# EAGLE design DC_IDE_Adapter (EAGLE 6.0)
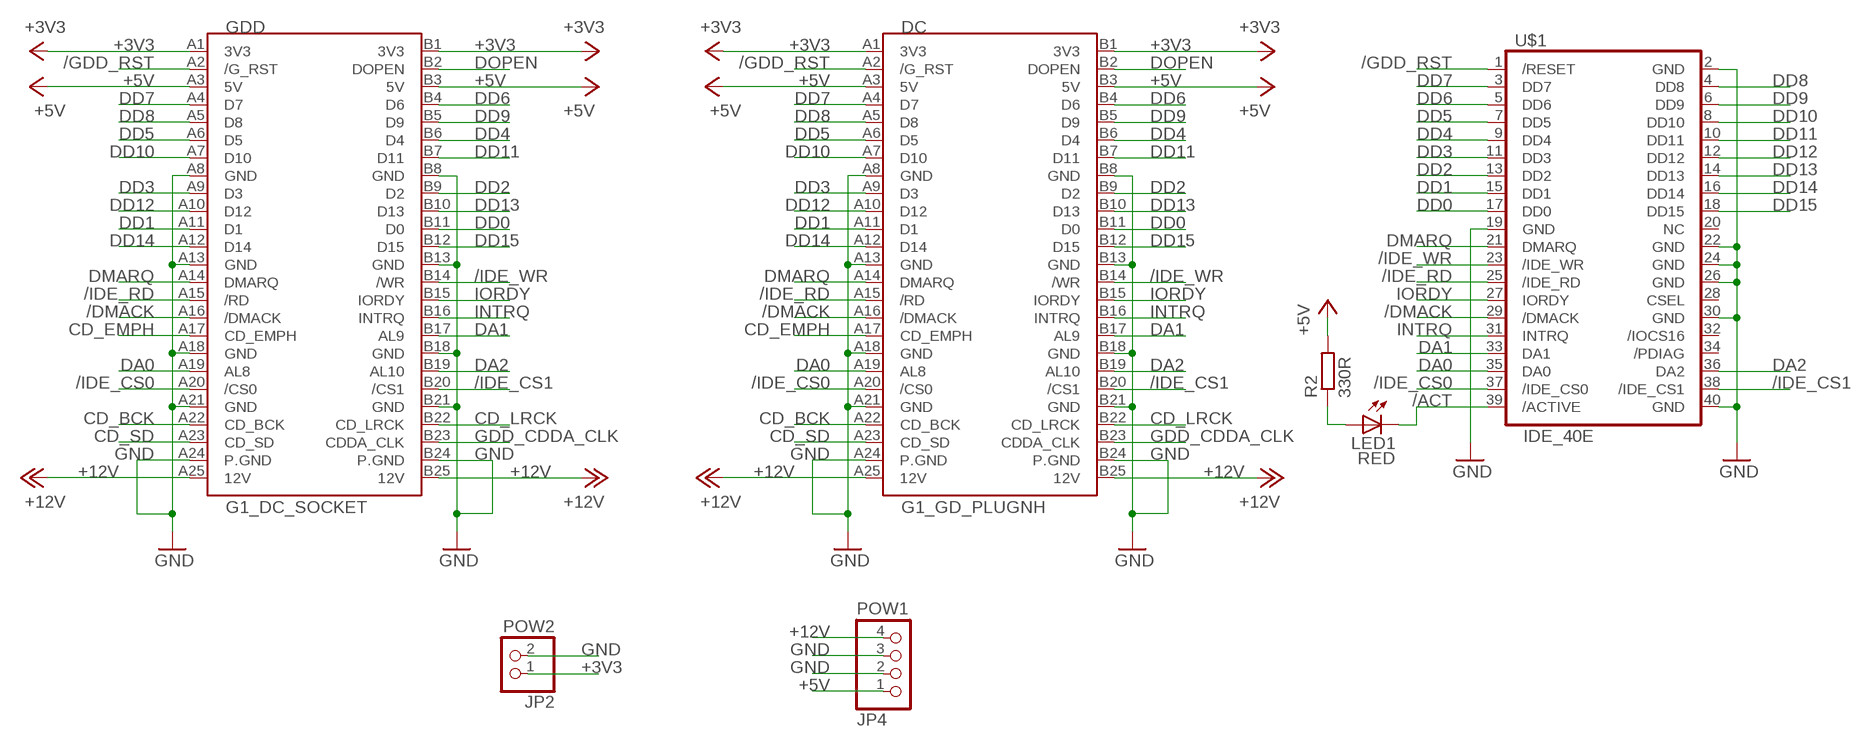
[diagram p0: schematic, sheet 1]

## Parts
DC  G1_GD_PLUGNH  [52584-0579-NOHOLES]
GDD  G1_DC_SOCKET  [53408-0579]
JP2  POW2  PINHD-1X2/90  [1X02/90]
JP4  POW1  PINHD-1X4/90  [1X04/90]
LED1  RED  LED3MM  [LED3MM]
R2  330R  R-EU_R0603  [R0603]
U$1  IDE_40E  [IDE_40_EDGE]

## Nets
+3V3: DC.A1(3V3) DC.B1(3V3) GDD.A1(3V3) GDD.B1(3V3) JP2.1
+5V: DC.A3(5V) DC.B3(5V) GDD.A3(5V) GDD.B3(5V) JP4.1 R2.2
+12V: DC.A25(12V) DC.B25(12V) GDD.A25(12V) GDD.B25(12V) JP4.4
/ACT: LED1.K(C) U$1.39(/ACTIVE)
/DMACK: DC.A16(/DMACK) GDD.A16(/DMACK) U$1.29(/DMACK)
/GDD_RST: DC.A2(/G_RST) GDD.A2(/G_RST) U$1.1(/RESET)
/IDE_CS0: DC.A20(/CS0) GDD.A20(/CS0) U$1.37(/IDE_CS0)
/IDE_CS1: DC.B20(/CS1) GDD.B20(/CS1) U$1.38(/IDE_CS1)
/IDE_RD: DC.A15(/RD) GDD.A15(/RD) U$1.25(/IDE_RD)
/IDE_WR: DC.B14(/WR) GDD.B14(/WR) U$1.23(/IDE_WR)
CD_BCK: DC.A22(CD_BCK) GDD.A22(CD_BCK)
CD_EMPH: DC.A17(CD_EMPH) GDD.A17(CD_EMPH)
CD_LRCK: DC.B22(CD_LRCK) GDD.B22(CD_LRCK)
CD_SD: DC.A23(CD_SD) GDD.A23(CD_SD)
DA0: DC.A19(AL8) GDD.A19(AL8) U$1.35(DA0)
DA1: DC.B17(AL9) GDD.B17(AL9) U$1.33(DA1)
DA2: DC.B19(AL10) GDD.B19(AL10) U$1.36(DA2)
DD0: DC.B11(D0) GDD.B11(D0) U$1.17(DD0)
DD1: DC.A11(D1) GDD.A11(D1) U$1.15(DD1)
DD2: DC.B9(D2) GDD.B9(D2) U$1.13(DD2)
DD3: DC.A9(D3) GDD.A9(D3) U$1.11(DD3)
DD4: DC.B6(D4) GDD.B6(D4) U$1.9(DD4)
DD5: DC.A6(D5) GDD.A6(D5) U$1.7(DD5)
DD6: DC.B4(D6) GDD.B4(D6) U$1.5(DD6)
DD7: DC.A4(D7) GDD.A4(D7) U$1.3(DD7)
DD8: DC.A5(D8) GDD.A5(D8) U$1.4(DD8)
DD9: DC.B5(D9) GDD.B5(D9) U$1.6(DD9)
DD10: DC.A7(D10) GDD.A7(D10) U$1.8(DD10)
DD11: DC.B7(D11) GDD.B7(D11) U$1.10(DD11)
DD12: DC.A10(D12) GDD.A10(D12) U$1.12(DD12)
DD13: DC.B10(D13) GDD.B10(D13) U$1.14(DD13)
DD14: DC.A12(D14) GDD.A12(D14) U$1.16(DD14)
DD15: DC.B12(D15) GDD.B12(D15) U$1.18(DD15)
DMARQ: DC.A14(DMARQ) GDD.A14(DMARQ) U$1.21(DMARQ)
DOPEN: DC.B2(DOPEN) GDD.B2(DOPEN)
GDD_CDDA_CLK: DC.B23(CDDA_CLK) GDD.B23(CDDA_CLK)
GND: DC.A8(GND) DC.A13(GND) DC.A18(GND) DC.A21(GND) DC.A24(P.GND) DC.B8(GND) DC.B13(GND) DC.B18(GND) DC.B21(GND) DC.B24(P.GND) GDD.A8(GND) GDD.A13(GND) GDD.A18(GND) GDD.A21(GND) GDD.A24(P.GND) GDD.B8(GND) GDD.B13(GND) GDD.B18(GND) GDD.B21(GND) GDD.B24(P.GND) JP2.2 JP4.2 JP4.3 U$1.2(GND) U$1.19(GND) U$1.22(GND) U$1.24(GND) U$1.26(GND) U$1.30(GND) U$1.40(GND)
INTRQ: DC.B16(INTRQ) GDD.B16(INTRQ) U$1.31(INTRQ)
IORDY: DC.B15(IORDY) GDD.B15(IORDY) U$1.27(IORDY)
N$1: LED1.A R2.1
Unconnected: U$1.20(NC) U$1.28(CSEL) U$1.32(/IOCS16) U$1.34(/PDIAG)

## Library data of the parts
DC = dreamcast:G1_GD_PLUG
GDD = dreamcast:G1_DC_SOCKET
JP2 = pinhead:PINHD-1X2: PIN HEADER
JP4 = pinhead:PINHD-1X4: PIN HEADER
LED1 = led:LED: LED OSRAM: - CHIPLED LG R971, LG N971, LY N971, LG Q971, LY Q971, LO R971, LY R971 LH N974, LH R974 LS Q976, LO Q976, LY Q976 LO Q996 - Hyper CHIPLED LW Q18S LB Q993, LB Q99A, LB R99A - SideLED LS A670, LO A670, LY A670, LG A670, LP A670 LB A673, LV A673, LT A673, LW A673 LH A674 LY A675 LS A676, LA A676, LO A676, LY A676, LW A676 LS A679, LY A679, LG A679 - Hyper Micro SIDELED® LS Y876, LA Y876, LO Y876, LY Y876 LT Y87S - SmartLED LW L88C, LW L88S LB L89C, LB L89S, LG L890 LS L89K, LO L89K, LY L89K LS L896, LA L896, LO L896, LY L896 - TOPLED LS T670, LO T670, LY T670, LG T670, LP T670 LSG T670, LSP T670, LSY T670, LOP T670, LYG T670 LG T671, LOG T671, LSG T671 LB T673, LV T673, LT T673, LW T673 LH T674 LS T676, LA T676, LO T676, LY T676, LB T676, LH T676, LSB T676, LW T676 LB T67C, LV T67C, LT T67C, LS T67K, LO T67K, LY T67K, LW E67C LS E67B, LA E67B, LO E67B, LY E67B, LB E67C, LV E67C, LT E67C LW T67C LS T679, LY T679, LG T679 LS T770, LO T770, LY T770, LG T770, LP T770 LB T773, LV T773, LT T773, LW T773 LH T774 LS E675, LA E675, LY E675, LS T675 LS T776, LA T776, LO T776, LY T776, LB T776 LHGB T686 LT T68C, LB T68C - Hyper Mini TOPLED® LB M676 - Mini TOPLED Santana® LG M470 LS M47K, LO M47K, LY M47K Source: http://www.osram.convergy.de LUXEON: - LUMILED® LXK2-PW12-R00, LXK2-PW12-S00, LXK2-PW14-U00, LXK2-PW14-V00 LXK2-PM12-R00, LXK2-PM12-S00, LXK2-PM14-U00 LXK2-PE12-Q00, LXK2-PE12-R00, LXK2-PE12-S00, LXK2-PE14-T00, LXK2-PE14-U00 LXK2-PB12-K00, LXK2-PB12-L00, LXK2-PB12-M00, LXK2-PB14-N00, LXK2-PB14-P00, LXK2-PB14-Q00 LXK2-PR12-L00, LXK2-PR12-M00, LXK2-PR14-Q00, LXK2-PR14-R00 LXK2-PD12-Q00, LXK2-PD12-R00, LXK2-PD12-S00 LXK2-PH12-R00, LXK2-PH12-S00 LXK2-PL12-P00, LXK2-PL12-Q00, LXK2-PL12-R00 Source: www.luxeon.com KINGBRIGHT: KA-3528ASYC Source: www.kingbright.com
R2 = rcl:R-EU_: RESISTOR, European symbol
U$1 = laptop_ide_44:IDE_40

## Board
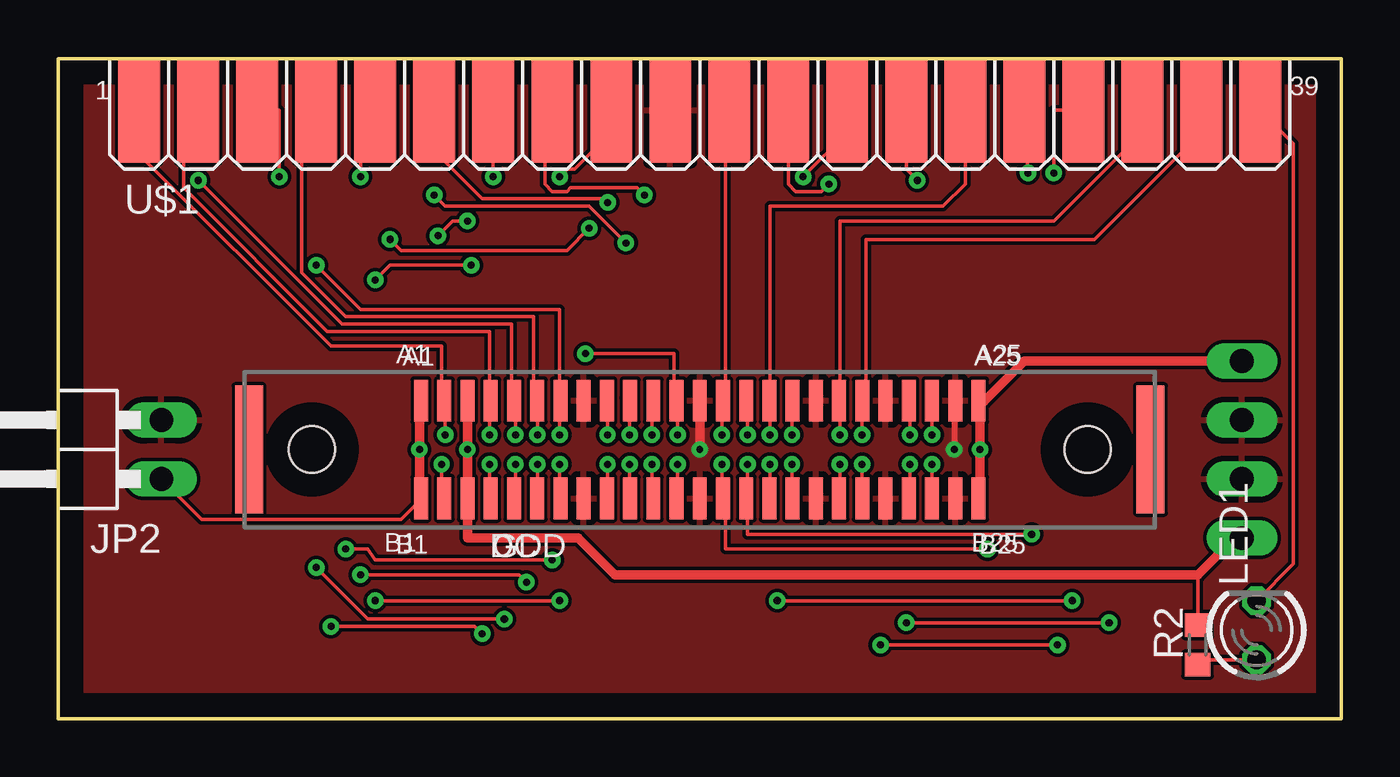
[diagram p1: board, top side]
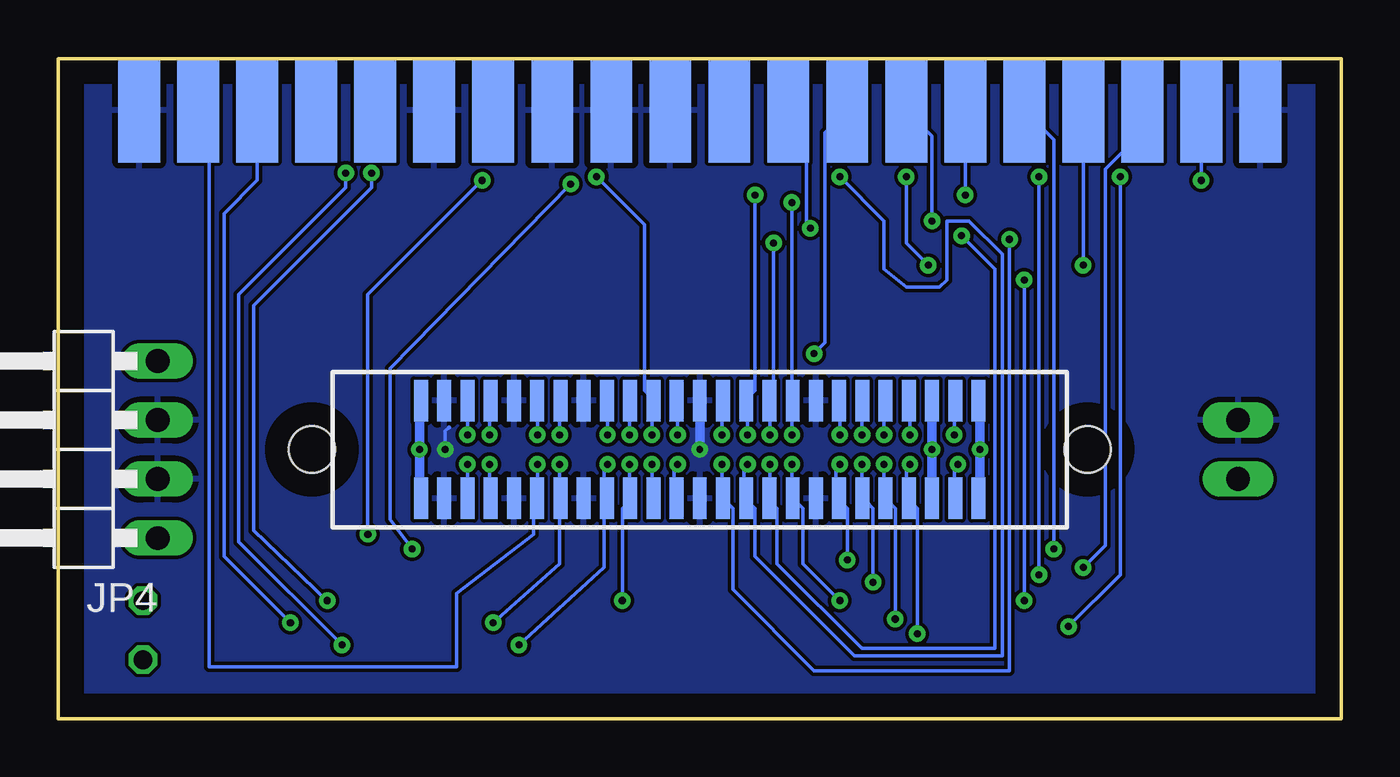
[diagram p2: board, bottom side, seen from below]

Size 55.24 x 28.42 mm. Coordinates in mm from the lower left corner, seen from the top.
Outline: 0,28.42 55.24,28.42 55.24,0 0,0 0,28.42
Copper layers (1*16): Top 0.035mm / dielectric 1.5mm / Bottom 0.035mm
Design rules: minimum track width 6mil, minimum drill 12mil, track to track 6mil, track to pad 6mil, pad to pad 6mil, via to via 6mil, smd to smd 8mil, copper to edge 40mil, drill to drill 20mil, minimum pad ring 8mil, minimum via ring 8mil, stop-mask expansion 6mil, vias tented up to drill 0mil, thermal gap 10mil

### Footprints (pad centres in the part's own frame; a part is rotated, then mirrored left to right if it is on the bottom)
52584-0579-NOHOLES = smd 0.6 x 1.8 bottom: A1 -12.001,2.1; A2 -11.001,2.1; A3 -10.001,2.1; A4 -9.001,2.1; A5 -8.001,2.1; A6 -7.001,2.1; A7 -6.001,2.1; A8 -5.001,2.1; A9 -4.001,2.1; A10 -3.001,2.1; A11 -2.001,2.1; A12 -1.001,2.1; A13 -0.001,2.1; A14 0.999,2.1; A15 1.999,2.1; A16 2.999,2.1; A17 3.999,2.1; A18 4.999,2.1; A19 5.999,2.1; A20 6.999,2.1; A21 7.999,2.1; A22 8.999,2.1; A23 9.999,2.1; A24 10.999,2.1; A25 11.999,2.1; B1 -12.001,-2.1; B2 -11.001,-2.1; B3 -10.001,-2.1; B4 -9.001,-2.1; B5 -8.001,-2.1; B6 -7.001,-2.1; B7 -6.001,-2.1; B8 -5.001,-2.1; B9 -4.001,-2.1; B10 -3.001,-2.1; B11 -2.001,-2.1; B12 -1.001,-2.1; B13 -0.001,-2.1; B14 0.999,-2.1; B15 1.999,-2.1; B16 2.999,-2.1; B17 3.999,-2.1; B18 4.999,-2.1; B19 5.999,-2.1; B20 6.999,-2.1; B21 7.999,-2.1; B22 8.999,-2.1; B23 9.999,-2.1; B24 10.999,-2.1; B25 11.999,-2.1
53408-0579 = smd 0.6 x 1.8: A1 -12,2.1; A2 -11,2.1; A3 -10,2.1; A4 -9,2.1; A5 -8,2.1; A6 -7,2.1; A7 -6,2.1; A8 -5,2.1; A9 -4,2.1; A10 -3,2.1; A11 -2,2.1; A12 -1,2.1; A13 0,2.1; A14 1,2.1; A15 2,2.1; A16 3,2.1; A17 4,2.1; A18 5,2.1; A19 6,2.1; A20 7,2.1; A21 8,2.1; A22 9,2.1; A23 10,2.1; A24 11,2.1; A25 12,2.1; B1 -12,-2.1; B2 -11,-2.1; B3 -10,-2.1; B4 -9,-2.1; B5 -8,-2.1; B6 -7,-2.1; B7 -6,-2.1; B8 -5,-2.1; B9 -4,-2.1; B10 -3,-2.1; B11 -2,-2.1; B12 -1,-2.1; B13 0,-2.1; B14 1,-2.1; B15 2,-2.1; B16 3,-2.1; B17 4,-2.1; B18 5,-2.1; B19 6,-2.1; B20 7,-2.1; B21 8,-2.1; B22 9,-2.1; B23 10,-2.1; B24 11,-2.1; B25 12,-2.1 | smd 1.2 x 5.5: P$1 -19.4,0; P$2 19.4,0 | hole 2: 16.7,0; -16.7,0
1X02/90 = drill 1.016 long: 1 -1.27,-3.81; 2 1.27,-3.81
1X04/90 = drill 1.016 long: 1 -3.81,-3.81; 2 -1.27,-3.81; 3 1.27,-3.81; 4 3.81,-3.81
LED3MM = drill 0.813 octagon: A -1.27,0; K 1.27,0
R0603 = smd 1 x 1.1: 1 -0.85,0; 2 0.85,0
IDE_40_EDGE = smd 1.8 x 4.5: 1 -24.13,0; 3 -21.59,0; 5 -19.05,0; 7 -16.51,0; 9 -13.97,0; 11 -11.43,0; 13 -8.89,0; 15 -6.35,0; 17 -3.81,0; 19 -1.27,0; 21 1.27,0; 23 3.81,0; 25 6.35,0; 27 8.89,0; 29 11.43,0; 31 13.97,0; 33 16.51,0; 35 19.05,0; 37 21.59,0; 39 24.13,0 | smd 1.8 x 4.5 bottom: 2 -24.13,0; 4 -21.59,0; 6 -19.05,0; 8 -16.51,0; 10 -13.97,0; 12 -11.43,0; 14 -8.89,0; 16 -6.35,0; 18 -3.81,0; 20 -1.27,0; 22 1.27,0; 24 3.81,0; 26 6.35,0; 28 8.89,0; 30 11.43,0; 32 13.97,0; 34 16.51,0; 36 19.05,0; 38 21.59,0; 40 24.13,0

### Placement (x,y rotation side)
DC  27.62,11.59 0 top
GDD  27.62,11.59 0 top
JP2  0.64,11.59 90 top
JP4  54.77,11.59 90 bottom
LED1  51.59,3.81 90 top
R2  49.05,3.17 90 top
U$1  27.62,26.19 0 top

### Tracks (layer width: path | path; a pad name or v marks a point on that pad's centre or on a via)
+3V3  (via drill 0.3)
  Top 0.152: 15.56,9.53 GDD.B1 15.56,9.37 14.76,8.57 6.19,8.57 JP2.1
  Top 0.406: GDD.A1 15.56,13.49 v15.56,11.59 15.56,9.53
  Bottom 0.152: 15.56,9.53 GDD.B1
  Bottom 0.406: GDD.A1 15.56,13.49 v15.56,11.59 15.56,9.53
+5V  (via drill 0.3)
  Top 0.152: 17.62,13.65 GDD.A3 | 17.62,9.53 GDD.B3 17.62,9.37 | 17.62,11.43 v17.62,11.59 | 49.05,6.19 R2.2
  Top 0.406: v17.62,11.59 17.62,13.65 | 17.62,11.43 17.62,9.53 | JP4.1 50.64,7.78 49.05,6.19 23.97,6.19 22.38,7.78 17.62,7.78 17.62,9.37
  Bottom 0.152: 17.62,9.53 GDD.B3 | 17.62,11.27 v17.62,11.59 | 17.62,13.81 GDD.A3 17.62,13.81
  Bottom 0.406: 17.62,11.43 v17.62,11.59 GDD.A3 | 17.62,11.27 17.62,9.53
+12V  (via drill 0.3)
  Top 0.152: 39.69,13.65 GDD.A25 39.85,13.65 | 39.69,9.53 GDD.B25 | 39.69,11.43 v39.69,11.59
  Top 0.406: 39.69,13.65 v39.69,11.59 | 39.69,11.43 39.69,9.53 | 39.85,13.65 41.59,15.4 JP4.4
  Bottom 0.152: 39.69,9.53 GDD.B25 | v39.69,11.59 | 39.69,13.18 GDD.A25 | 39.69,11.75 v39.69,11.59
  Bottom 0.406: 39.69,13.34 39.62,13.56 GDD.A25 | v39.69,11.59 39.69,9.53 | 39.69,11.75 39.69,13.18
/ACT
  Top 0.152: LED1.K 53.18,6.67 53.18,24.77 U$1.39
/DMACK  (via drill 0.3)
  Top 0.152: v30.64,12.22 30.64,13.65 GDD.A16 30.64,13.81 30.64,22.07 38.1,22.07 39.05,23.02 U$1.29
  Bottom 0.152: v30.64,12.22 30.64,13.65 GDD.A16
  Bottom 0.203: 30.64,13.81 GDD.A16
/GDD_RST  (via drill 0.3)
  Top 0.152: v16.67,12.22 16.67,13.64 DC.A2 16.51,13.81 16.51,16.03 11.75,16.03 3.49,24.29 U$1.1
  Bottom 0.152: v16.67,12.22 16.67,13.69 DC.A2
/IDE_CS0  (via drill 0.3)
  Top 0.152: v34.61,12.22 34.61,13.65 GDD.A20 | 34.77,13.81 34.77,20.64 44.61,20.64 49.21,25.24 U$1.37
  Top 0.203: 34.77,13.81 GDD.A20
  Bottom 0.152: v34.61,12.22 34.61,13.65 GDD.A20 34.61,13.81
/IDE_CS1  (via drill 0.3)
  Top 0.152: v34.61,10.95 34.61,9.53 GDD.B20 | v34.61,10.95
  Bottom 0.152: v34.61,10.95 34.61,9.53 GDD.B20 34.77,9.37 34.77,7.94 38.1,5.4 38.1,2.22 48.74,2.22 48.74,25.72 U$1.38 | v34.61,10.95
/IDE_RD  (via drill 0.3)
  Top 0.152: v29.69,12.22 29.69,13.65 GDD.A15 | v32.07,23.34 33.97,25.24 U$1.25
  Bottom 0.152: v29.69,12.22 29.69,13.65 GDD.A15 29.69,13.81 | 29.69,13.81 30,14.13 30,21.27 v32.07,23.34
  Bottom 0.203: 29.69,13.81 GDD.A15
/IDE_WR  (via drill 0.3)
  Top 0.152: v28.57,10.95 28.57,9.53 GDD.B14 28.73,9.37 28.73,7.3 v40,7.3 | v28.57,10.95 | v33.18,23.02 32.86,22.7 31.75,22.7 31.43,23.02 U$1.23
  Bottom 0.152: GDD.B14 28.73,9.53 28.73,10.95 v28.57,10.95 | v40,7.3 40.96,8.57 40.96,15.08 v33.18,23.02
CD_BCK  (via drill 0.3)
  Top 0.152: v36.67,12.22 36.67,13.65 GDD.A22
  Bottom 0.152: v36.67,12.22 36.67,13.65 GDD.A22
CD_EMPH  (via drill 0.3)
  Top 0.152: v31.59,12.22 31.59,13.65 GDD.A17
  Bottom 0.152: v31.59,12.22 31.59,13.65 GDD.A17
CD_LRCK  (via drill 0.3)
  Top 0.152: v36.67,10.95 36.67,9.53 GDD.B22 | v36.67,10.95
  Bottom 0.152: v36.67,10.95 36.67,9.53 GDD.B22 | v36.67,10.95
CD_SD  (via drill 0.3)
  Top 0.152: v37.62,12.22 37.62,13.65 GDD.A23
  Bottom 0.152: v37.62,12.22 37.62,13.65 GDD.A23
DA0  (via drill 0.3)
  Top 0.152: v33.65,12.22 33.65,13.65 GDD.A19 | 33.65,13.81 33.65,21.43 42.86,21.43 46.67,25.24 U$1.35
  Top 0.203: 33.65,13.81 GDD.A19
  Bottom 0.152: v33.65,12.22 33.65,13.65 GDD.A19 33.65,13.81
DA1  (via drill 0.3)
  Top 0.152: v31.59,10.95 31.59,9.53 GDD.B17 | v43.02,3.17 v35.4,3.17 | v42.86,23.5 42.86,26.19 U$1.33
  Bottom 0.152: v31.59,10.95 31.75,10.95 31.75,9.53 GDD.B17 31.75,9.37 31.75,6.51 v35.4,3.17 | v43.02,3.17 47.47,7.62 47.47,18.26 42.86,22.86 v42.86,23.5
DA2  (via drill 0.3)
  Top 0.152: v33.65,10.95 33.65,9.53 GDD.B19 | v33.65,10.95 | v45.24,4.13 v36.51,4.13
  Bottom 0.152: v33.65,10.95 33.65,9.53 GDD.B19 33.65,9.37 33.65,6.67 v36.51,4.13 | v33.65,10.95 | v45.24,4.13 48.1,6.98 48.1,21.75 46.67,23.18 U$1.36
DD0  (via drill 0.3)
  Top 0.152: v25.56,10.95 25.56,9.53 GDD.B11 | v25.56,10.95 | v21.59,23.34 21.91,23.65 22.22,23.65 23.81,25.24 U$1.17
  Bottom 0.152: v25.56,10.95 25.72,10.95 25.72,9.53 GDD.B11 25.56,9.37 25.24,9.05 25.24,6.98 20.95,2.7 14.6,2.7 14.6,20 16.03,21.43 16.99,21.43 16.99,18.89 17.3,18.57 18.73,18.57 19.68,19.37 19.68,21.43 v21.59,23.34
DD1  (via drill 0.3)
  Top 0.152: v25.56,12.22 25.56,13.65 GDD.A11 | v25.24,22.54 24.92,22.86 22.07,22.86 21.91,22.7 21.27,22.7 20.95,23.02 20.95,26.19 U$1.15
  Bottom 0.152: v25.56,12.22 25.56,13.65 GDD.A11 25.56,13.81 25.24,14.13 v25.24,22.54
DD2  (via drill 0.3)
  Top 0.152: v23.65,10.95 23.65,9.53 GDD.B9 | v23.65,10.95 | v13.65,5.08 v21.59,5.08 | v13.65,18.89 14.29,19.53 v17.78,19.53 | v18.73,23.34 18.73,25.72 18.26,26.19 U$1.13
  Bottom 0.152: v23.65,10.95 23.65,9.53 GDD.B9 23.49,9.37 23.18,9.05 23.18,6.67 v21.59,5.08 | v23.65,10.95 | v13.65,18.89 v13.65,5.08 | v17.78,19.53 18.73,20.48 v18.73,23.34
DD3  (via drill 0.3)
  Top 0.152: v23.65,12.22 23.65,13.65 GDD.A9 | v23.65,22.23 23.49,22.38 18.26,22.38 16.19,24.45 U$1.11
  Bottom 0.152: v23.65,12.22 23.65,13.65 GDD.A9 23.65,13.81 v23.65,22.23
DD4  (via drill 0.3)
  Top 0.152: v20.64,10.95 20.64,9.53 GDD.B6 | v20.64,10.95 | v20.16,5.87 19.84,6.19 v13.02,6.19 | v13.02,23.34 13.02,26.19 U$1.9
  Bottom 0.152: v20.64,10.95 20.64,9.53 GDD.B6 20.48,9.37 20.16,9.05 v20.16,5.87 | v20.64,10.95 | v13.02,23.34 v13.02,6.19
DD5  (via drill 0.3)
  Top 0.152: v20.64,12.22 20.64,13.65 GDD.A6 20.48,13.81 20.48,17.3 12.38,17.3 10.48,19.21 10.48,26.19 U$1.7
  Bottom 0.152: v20.64,12.22 20.64,13.65 GDD.A6
  Bottom 0.203: 20.48,13.81 GDD.A6
DD6  (via drill 0.3)
  Top 0.152: v18.57,10.95 18.57,9.53 GDD.B4 | v18.57,10.95 | v18.26,3.65 17.94,3.97 v11.75,3.97 | v9.52,23.34 9.52,26.19 U$1.5
  Bottom 0.152: v18.57,10.95 18.73,10.95 18.73,9.53 GDD.B4 18.57,9.37 18.26,9.05 v18.26,3.65 | v11.75,3.97 9.52,6.19 v9.52,23.34
DD7  (via drill 0.3)
  Top 0.152: v18.57,12.22 18.57,13.65 GDD.A4 18.57,13.81 18.57,16.67 11.59,16.67 5.4,22.86 5.4,26.19 U$1.3
  Bottom 0.152: v18.57,12.22 18.57,13.65 GDD.A4 18.73,13.81
DD8  (via drill 0.3)
  Top 0.152: v19.68,12.22 19.68,13.65 GDD.A5 19.53,13.81 19.53,16.99 12.22,16.99 v6.03,23.18
  Bottom 0.152: v19.68,12.22 19.68,13.65 GDD.A5 | U$1.4 v6.03,23.18
DD9  (via drill 0.3)
  Top 0.152: v19.68,10.95 19.68,9.53 GDD.B5 | v19.68,10.95 | v19.21,4.29 13.33,4.29 v11.11,6.51
  Bottom 0.152: v19.68,10.95 19.68,9.53 GDD.B5 19.53,9.37 19.21,9.05 v19.21,4.29 | v19.68,10.95 | v11.11,6.51 10.16,7.46 10.16,23.65 8.57,25.24 U$1.6
DD10  (via drill 0.3)
  Top 0.152: v21.59,12.22 21.59,13.65 GDD.A7 21.59,13.81 21.59,17.62 13.02,17.62 v11.11,19.53
  Bottom 0.152: v21.59,12.22 21.59,13.65 GDD.A7 | U$1.8 v11.11,19.53
  Bottom 0.203: 21.59,13.81 GDD.A7
DD11  (via drill 0.3)
  Top 0.152: v21.59,10.95 21.59,9.53 GDD.B7 | v21.59,10.95 | v21.27,6.83 13.65,6.83 13.33,7.3 v12.38,7.3
  Bottom 0.152: v21.59,10.95 21.75,10.95 21.75,9.53 GDD.B7 21.59,9.37 21.27,9.05 v21.27,6.83 | v12.38,7.3 12.38,24.92 U$1.10
DD12  (via drill 0.3)
  Top 0.152: v24.61,12.22 24.61,13.65 GDD.A10 | v24.45,20.48 22.86,22.07 16.67,22.07 v16.19,22.54
  Top 0.254: 24.45,13.81 GDD.A10
  Bottom 0.152: v24.61,12.22 24.61,13.65 GDD.A10 24.61,13.81 24.45,13.97 v24.45,20.48 | U$1.12 v16.19,22.54
DD13  (via drill 0.3)
  Top 0.152: v24.61,10.95 24.61,9.53 GDD.B10 | v24.61,10.95 | v16.35,20.8 16.99,21.43 v17.62,21.43
  Bottom 0.152: v24.61,10.95 24.61,9.53 GDD.B10 24.61,9.37 24.29,9.05 24.29,6.67 20.64,3.02 14.92,3.02 14.92,19.37 v16.35,20.8 | v24.61,10.95 | v17.62,21.43 17.62,25.08 U$1.14
DD14  (via drill 0.3)
  Top 0.152: v26.67,12.22 26.67,13.65 GDD.A12 26.51,13.81 26.51,15.72 v22.7,15.72
  Bottom 0.152: v26.67,12.22 26.67,13.65 GDD.A12 26.51,13.81 | 26.51,13.81 | v22.7,15.72 22.22,16.19 22.22,25.24 U$1.16
  Bottom 0.203: 26.51,13.81 GDD.A12
DD15  (via drill 0.3)
  Top 0.152: v26.67,10.95 26.67,9.53 GDD.B12 | v26.67,10.95 | v14.29,20.64 14.76,20.16 21.91,20.16 v22.86,21.11
  Bottom 0.152: v26.67,10.95 26.67,9.53 GDD.B12 26.51,9.37 26.19,9.05 26.19,5.56 22.7,2.06 14.29,2.06 v14.29,20.64 | v26.67,10.95 | v22.86,21.11 23.02,21.27 23.02,25.4 U$1.18
DMARQ  (via drill 0.3)
  Top 0.152: v28.57,12.22 28.57,13.65 GDD.A14 28.73,13.81 28.73,26.19 U$1.21
  Bottom 0.152: v28.57,12.22 28.57,13.65 GDD.A14 | 28.73,13.81
  Bottom 0.203: 28.73,13.81 GDD.A14
DOPEN  (via drill 0.3)
  Top 0.152: v16.51,10.95 16.51,9.53 DC.B2 | v16.51,10.95
  Bottom 0.152: DC.B2 16.67,9.53 16.67,10.95 v16.51,10.95
GDD_CDDA_CLK  (via drill 0.3)
  Top 0.152: v37.62,10.95 37.62,9.53 DC.B23
  Bottom 0.152: v37.62,10.95 37.62,9.53 DC.B23
GND  (via drill 0.3)
  Top 0.254: 27.62,13.65 GDD.A13 | v38.58,11.59 38.58,13.49 GDD.A24 38.58,13.81 | 35.72,13.81 GDD.A21 | 32.54,13.81 GDD.A18
  Top 0.406: 27.62,13.65 v27.62,11.59
  Bottom 0.152: 38.42,12.54 38.58,12.38 v38.58,11.59
  Bottom 0.203: GDD.A24 38.58,13.65 38.67,13.64 | 38.42,12.54
  Bottom 0.254: 27.62,13.65 GDD.A13 | 32.54,13.81 GDD.A18
  Bottom 0.406: 27.62,13.65 v27.62,11.59
  pour Top: 0,28.42 55.24,28.42 55.24,0 0,0
  pour Bottom: 0,28.42 55.24,28.42 55.24,0 0,0
INTRQ  (via drill 0.3)
  Top 0.152: v30.64,10.95 30.64,9.53 GDD.B16 | v30.64,10.95 | v43.66,5.08 v30.96,5.08 | U$1.31 v41.75,23.5
  Bottom 0.152: v30.64,10.95 30.64,9.53 GDD.B16 30.64,9.37 30.96,9.05 v30.96,5.08 | v30.64,10.95 | v43.66,5.08 46.83,8.1 46.83,17.78 41.75,22.86 v41.75,23.5
IORDY  (via drill 0.3)
  Top 0.152: v29.69,10.95 29.69,9.53 GDD.B15 29.69,9.37 29.69,7.94 v41.91,7.94 | v36.99,23.18 36.51,23.65 U$1.27
  Bottom 0.152: GDD.B15 29.69,9.53 v29.69,10.95 | v41.91,7.94 41.91,18.26 v36.99,23.18
N$1
  Top 0.152: LED1.A 49.21,2.54 49.05,2.38 R2.1

### Text on the board
Document: G1 Adapter v1.2 | OzOnE 2014